# EAGLE design MTX_pic_piggyback_V11 (EAGLE 6.1)
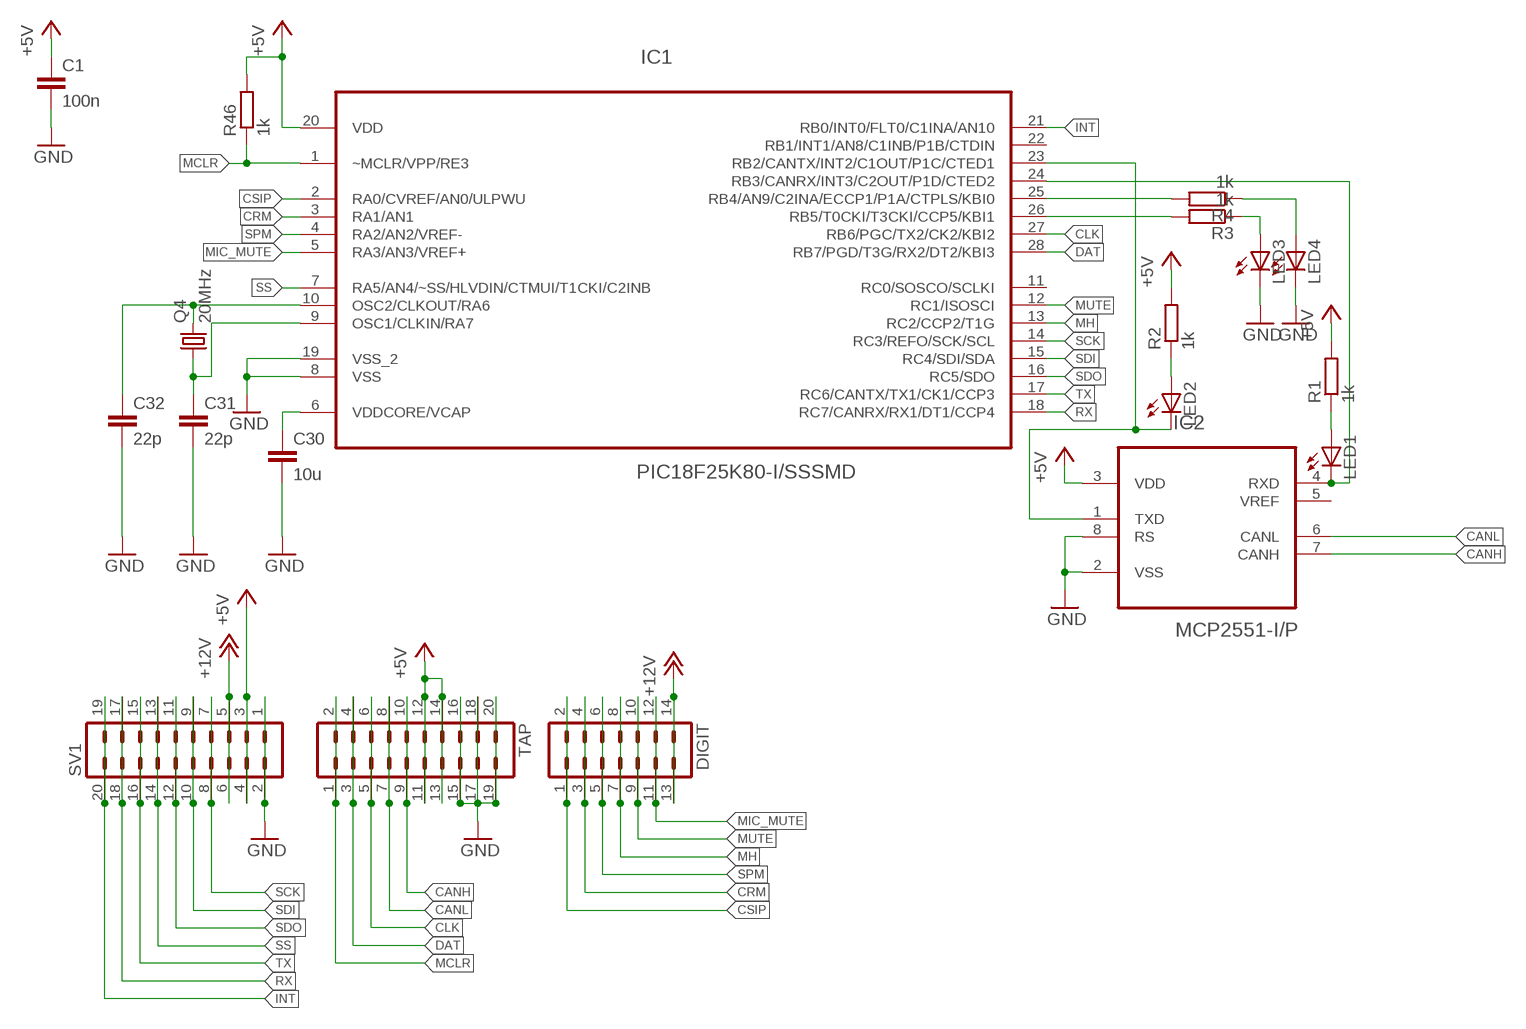
[diagram p0: schematic, sheet 1]

## Parts
C1  100n  C-EUC0805  [C0805]
C30  10u  C-EUC0805  [C0805]
C31  22p  C-EUC0805  [C0805]
C32  22p  C-EUC0805  [C0805]
DIGIT  MA07-2  [MA07-2]
IC1  PIC18F25K80-I/SSSMD  [SOP65P780X200-28N]
IC2  MCP2551-I/P  [DIP254P762X432-8]
LED1  LEDCHIP-LED0805  [CHIP-LED0805]
LED2  LEDCHIP-LED0805  [CHIP-LED0805]
LED3  LEDCHIP-LED0805  [CHIP-LED0805]
LED4  LEDCHIP-LED0805  [CHIP-LED0805]
Q4  20MHz  CRYSTALHC49UP  [HC49UP]
R1  1k  R-EU_R0805  [R0805]
R2  1k  R-EU_R0805  [R0805]
R3  1k  R-EU_R0805  [R0805]
R4  1k  R-EU_R0805  [R0805]
R46  1k  R-EU_R0805  [R0805]
SV1  MA10-2  [MA10-2]
TAP  MA10-2  [MA10-2]

## Nets
+5V: C1.1 IC1.20(VDD) IC2.3(VDD) R1.2 R2.2 R46.2 SV1.3 SV1.4 TAP.11 TAP.12 TAP.13 TAP.14
+12V: DIGIT.13 DIGIT.14 SV1.5 SV1.6
CANH: IC2.7(CANH) TAP.9 TAP.10
CANL: IC2.6(CANL) TAP.7 TAP.8
CLK: IC1.27(RB6/PGC/TX2/CK2/KBI2) TAP.5 TAP.6
CRM: DIGIT.3 DIGIT.4 IC1.3(RA1/AN1)
CSIP: DIGIT.1 DIGIT.2 IC1.2(RA0/CVREF/AN0/ULPWU)
DAT: IC1.28(RB7/PGD/T3G/RX2/DT2/KBI3) TAP.3 TAP.4
GND: C1.2 C30.2 C31.2 C32.2 IC1.8(VSS) IC1.19(VSS_2) IC2.2(VSS) IC2.8(RS) LED3.C LED4.C SV1.1 SV1.2 TAP.15 TAP.16 TAP.17 TAP.18 TAP.19 TAP.20
INT: IC1.21(RB0/INT0/FLT0/C1INA/AN10) SV1.19 SV1.20
MCLR: IC1.1(~MCLR/VPP/RE3) R46.1 TAP.1 TAP.2
MH: DIGIT.7 DIGIT.8 IC1.13(RC2/CCP2/T1G)
MIC_MUTE: DIGIT.11 DIGIT.12 IC1.5(RA3/AN3/VREF+)
MUTE: DIGIT.9 DIGIT.10 IC1.12(RC1/ISOSCI)
N$1: LED1.A R1.1
N$2: LED2.A R2.1
N$3: LED3.A R3.1
N$4: IC1.26(RB5/T0CKI/T3CKI/CCP5/KBI1) R3.2
N$5: LED4.A R4.1
N$6: IC1.25(RB4/AN9/C2INA/ECCP1/P1A/CTPLS/KBI0) R4.2
N$57: C30.1 IC1.6(VDDCORE/VCAP)
N$58: C31.1 IC1.9(OSC1/CLKIN/RA7) Q4.1
N$59: C32.1 IC1.10(OSC2/CLKOUT/RA6) Q4.2
N$86: IC1.24(RB3/CANRX/INT3/C2OUT/P1D/CTED2) IC2.4(RXD) LED1.C
N$87: IC1.23(RB2/CANTX/INT2/C1OUT/P1C/CTED1) IC2.1(TXD) LED2.C
RX: IC1.18(RC7/CANRX/RX1/DT1/CCP4) SV1.17 SV1.18
SCK: IC1.14(RC3/REFO/SCK/SCL) SV1.7 SV1.8
SDI: IC1.15(RC4/SDI/SDA) SV1.9 SV1.10
SDO: IC1.16(RC5/SDO) SV1.11 SV1.12
SPM: DIGIT.5 DIGIT.6 IC1.4(RA2/AN2/VREF-)
SS: IC1.7(RA5/AN4/~SS/HLVDIN/CTMUI/T1CKI/C2INB) SV1.13 SV1.14
TX: IC1.17(RC6/CANTX/TX1/CK1/CCP3) SV1.15 SV1.16
Unconnected: IC1.11(RC0/SOSCO/SCLKI) IC1.22(RB1/INT1/AN8/C1INB/P1B/CTDIN) IC2.5(VREF)

## Library data of the parts
C1 C30-C32 = rcl:C-EU: CAPACITOR, European symbol
DIGIT = con-lstb:MA07-2: PIN HEADER; OC_FARNELL: unknown; OC_NEWARK: unknown
IC1 = Microchip_By_element14_Batch_1:PIC18F25K80-I/SS
IC2 = Microchip_By_element14_Batch_1:MCP2551-I/P: High-Speed CAN Transceiver; DESCRIPTION: CAN CTRL; MPN: MCP2551-I/P; OC_FARNELL: 1292240; OC_NEWARK: 61K2947; PACKAGE: PDIP-8; SUPPLIER: Microchip
LED1-LED4 = led:LED: LED OSRAM: - CHIPLED LG R971, LG N971, LY N971, LG Q971, LY Q971, LO R971, LY R971 LH N974, LH R974 LS Q976, LO Q976, LY Q976 LO Q996 - Hyper CHIPLED LW Q18S LB Q993, LB Q99A, LB R99A - SideLED LS A670, LO A670, LY A670, LG A670, LP A670 LB A673, LV A673, LT A673, LW A673 LH A674 LY A675 LS A676, LA A676, LO A676, LY A676, LW A676 LS A679, LY A679, LG A679 - Hyper Micro SIDELED® LS Y876, LA Y876, LO Y876, LY Y876 LT Y87S - SmartLED LW L88C, LW L88S LB L89C, LB L89S, LG L890 LS L89K, LO L89K, LY L89K LS L896, LA L896, LO L896, LY L896 - TOPLED LS T670, LO T670, LY T670, LG T670, LP T670 LSG T670, LSP T670, LSY T670, LOP T670, LYG T670 LG T671, LOG T671, LSG T671 LB T673, LV T673, LT T673, LW T673 LH T674 LS T676, LA T676, LO T676, LY T676, LB T676, LH T676, LSB T676, LW T676 LB T67C, LV T67C, LT T67C, LS T67K, LO T67K, LY T67K, LW E67C LS E67B, LA E67B, LO E67B, LY E67B, LB E67C, LV E67C, LT E67C LW T67C LS T679, LY T679, LG T679 LS T770, LO T770, LY T770, LG T770, LP T770 LB T773, LV T773, LT T773, LW T773 LH T774 LS E675, LA E675, LY E675, LS T675 LS T776, LA T776, LO T776, LY T776, LB T776 LHGB T686 LT T68C, LB T68C - Hyper Mini TOPLED® LB M676 - Mini TOPLED Santana® LG M470 LS M47K, LO M47K, LY M47K Source: http://www.osram.convergy.de LUXEON: - LUMILED® LXK2-PW12-R00, LXK2-PW12-S00, LXK2-PW14-U00, LXK2-PW14-V00 LXK2-PM12-R00, LXK2-PM12-S00, LXK2-PM14-U00 LXK2-PE12-Q00, LXK2-PE12-R00, LXK2-PE12-S00, LXK2-PE14-T00, LXK2-PE14-U00 LXK2-PB12-K00, LXK2-PB12-L00, LXK2-PB12-M00, LXK2-PB14-N00, LXK2-PB14-P00, LXK2-PB14-Q00 LXK2-PR12-L00, LXK2-PR12-M00, LXK2-PR14-Q00, LXK2-PR14-R00 LXK2-PD12-Q00, LXK2-PD12-R00, LXK2-PD12-S00 LXK2-PH12-R00, LXK2-PH12-S00 LXK2-PL12-P00, LXK2-PL12-Q00, LXK2-PL12-R00 Source: www.luxeon.com KINGBRIGHT: KA-3528ASYC Source: www.kingbright.com
Q4 = crystal:CRYSTAL: CRYSTAL; OC_FARNELL: unknown; OC_NEWARK: unknown
R1-R4 R46 = rcl:R-EU_: RESISTOR, European symbol
SV1 TAP = con-lstb:MA10-2: PIN HEADER; OC_FARNELL: unknown; OC_NEWARK: unknown

## Board
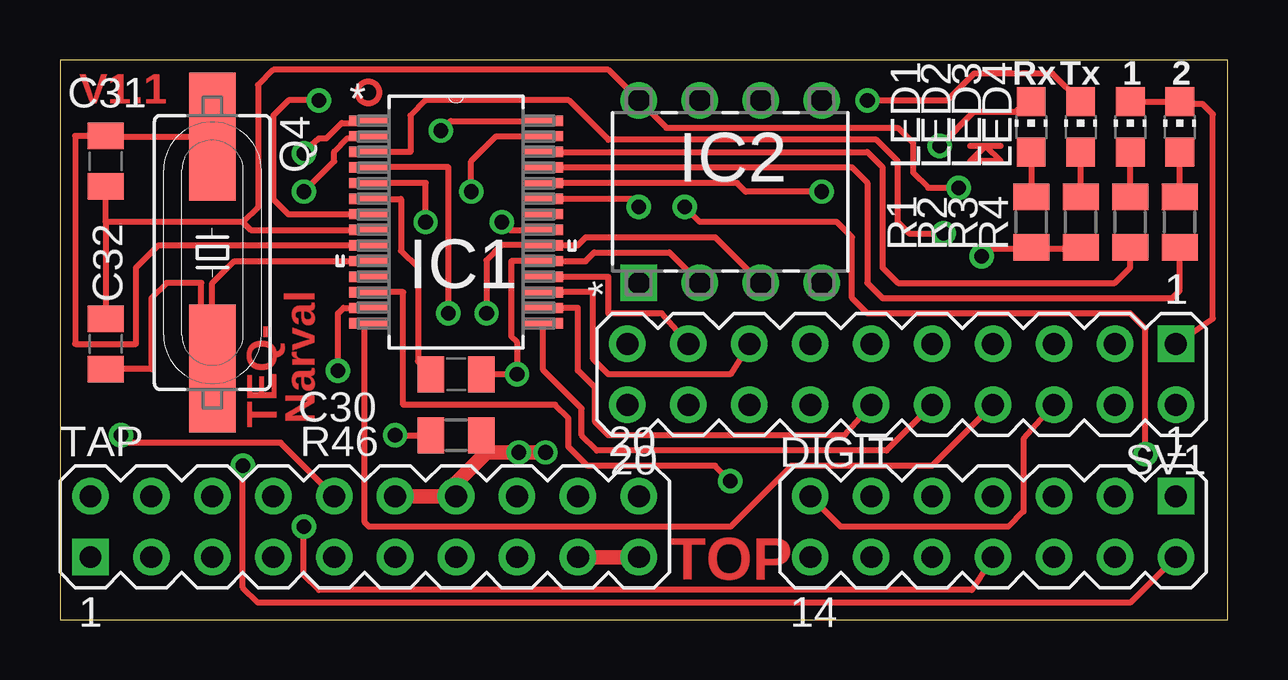
[diagram p1: board, top side]
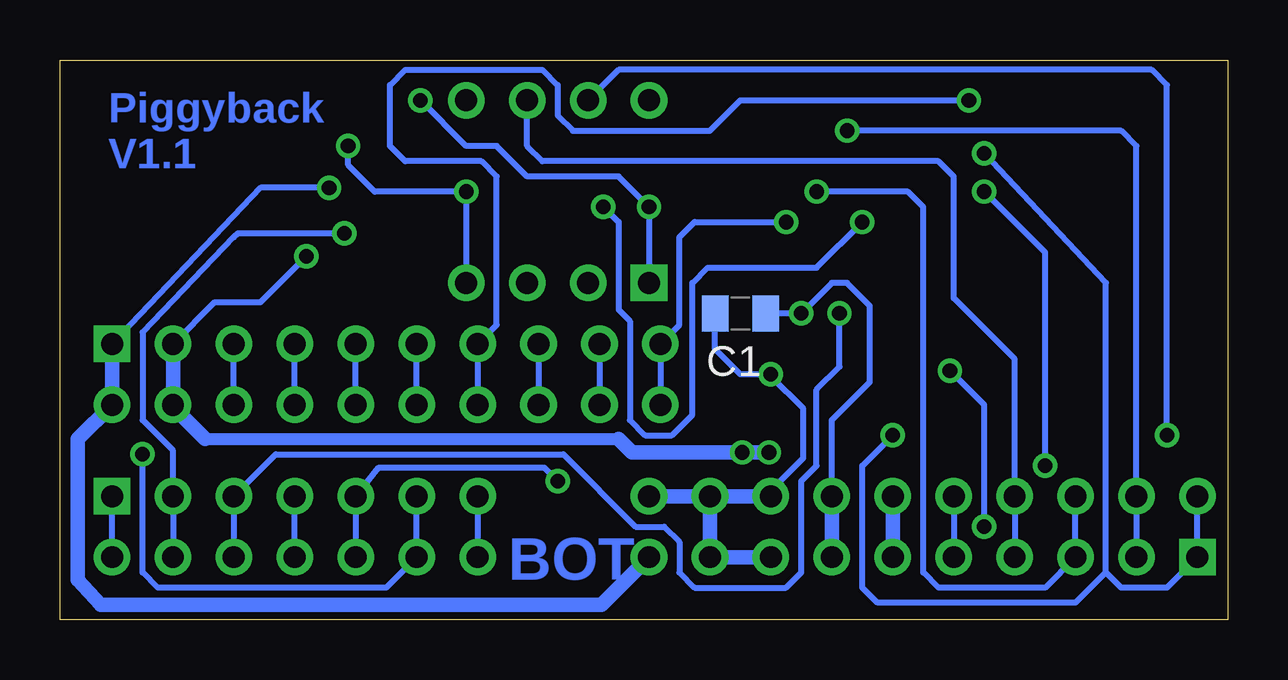
[diagram p2: board, bottom side, seen from below]

Size 48.68 x 23.35 mm. Coordinates in mm from the lower left corner, seen from the top.
Outline: 0,0 48.68,0 48.68,23.35 0,23.35 0,0
Copper layers (1*16): Top 0.035mm / dielectric 1.5mm / Bottom 0.035mm
Design rules: minimum track width 10mil, minimum drill 24mil, track to track 10mil, track to pad 10mil, pad to pad 10mil, via to via 10mil, smd to smd 10mil, copper to edge 10mil, drill to drill 10mil, minimum pad ring 10mil, minimum via ring 8mil, stop-mask expansion 4mil, vias tented up to drill 0mil, thermal gap 10mil

### Footprints (pad centres in the part's own frame; a part is rotated, then mirrored left to right if it is on the bottom)
C0805 = smd 1.1 x 1.5: 1 -1.05,0; 2 1.05,0
MA07-2 = drill 0.914 pad 1.524 square: 1 -7.62,-1.27 | drill 0.914 pad 1.524: 2 -7.62,1.27; 3 -5.08,-1.27; 4 -5.08,1.27; 5 -2.54,-1.27; 6 -2.54,1.27; 7 0,-1.27; 8 0,1.27; 9 2.54,-1.27; 10 2.54,1.27; 11 5.08,-1.27; 12 5.08,1.27; 13 7.62,-1.27; 14 7.62,1.27
SOP65P780X200-28N = smd 1.651 x 0.432: 1 -3.632,4.216; 2 -3.632,3.581; 3 -3.632,2.921; 4 -3.632,2.286; 5 -3.632,1.626; 6 -3.632,0.965; 7 -3.632,0.33; 8 -3.632,-0.33; 9 -3.632,-0.965; 10 -3.632,-1.626; 11 -3.632,-2.286; 12 -3.632,-2.921; 13 -3.632,-3.581; 14 -3.632,-4.216; 15 3.632,-4.216; 16 3.632,-3.581; 17 3.632,-2.921; 18 3.632,-2.286; 19 3.632,-1.626; 20 3.632,-0.965; 21 3.632,-0.33; 22 3.632,0.33; 23 3.632,0.965; 24 3.632,1.626; 25 3.632,2.286; 26 3.632,2.921; 27 3.632,3.581; 28 3.632,4.216
DIP254P762X432-8 = drill 0.914 pad 1.524 square: 1 -3.81,3.81 | drill 0.914 pad 1.524: 2 -3.81,1.27; 3 -3.81,-1.27; 4 -3.81,-3.81; 5 3.81,-3.81; 6 3.81,-1.27; 7 3.81,1.27; 8 3.81,3.81
CHIP-LED0805 = smd 1.2 x 1.2: A 0,-1.05; C 0,1.05
HC49UP = smd 5.334 x 1.93: 1 -4.826,0; 2 4.826,0
R0805 = smd 1.1 x 1.5: 1 -1.05,0; 2 1.05,0
MA10-2 = drill 0.914 pad 1.524 square: 1 -11.43,-1.27 | drill 0.914 pad 1.524: 2 -11.43,1.27; 3 -8.89,-1.27; 4 -8.89,1.27; 5 -6.35,-1.27; 6 -6.35,1.27; 7 -3.81,-1.27; 8 -3.81,1.27; 9 -1.27,-1.27; 10 -1.27,1.27; 11 1.27,-1.27; 12 1.27,1.27; 13 3.81,-1.27; 14 3.81,1.27; 15 6.35,-1.27; 16 6.35,1.27; 17 8.89,-1.27; 18 8.89,1.27; 19 11.43,-1.27; 20 11.43,1.27

### Placement (x,y rotation side)
C1  20.32,12.78 180 bottom
C30  16.51,10.24 0 top
C31  1.91,19.13 270 top
C32  1.91,11.51 90 top
DIGIT  38.89,3.89 180 top
IC1  16.51,16.59 0 top
IC2  27.94,17.86 90 top
LED1  40.48,20.56 0 top
LED2  42.55,20.56 0 top
LED3  44.61,20.56 0 top
LED4  46.67,20.56 0 top
Q4  6.35,15.32 270 top
R1  40.48,16.59 270 top
R2  42.55,16.59 270 top
R3  44.61,16.59 270 top
R4  46.67,16.59 270 top
R46  16.51,7.7 0 top
SV1  35.08,10.24 180 top
TAP  12.7,3.89 0 top

### Tracks (layer width: path | path; a pad name or v marks a point on that pad's centre or on a via)
+5V  (via drill 0.61, 0.61 pad 1.02)
  Top 0.254: IC2.3 27.3,15.95 21.92,15.95 21.59,15.62 IC1.20 18.41,15.62 17.78,14.99 v17.78,12.78 | v38.42,15.16 38.58,15.48 40.32,15.48 40.32,15.64 40.48,15.48 40.64,15.48 42.47,15.48 42.55,15.48
  Top 0.61: TAP.12 TAP.14 16.51,5.72 17.78,6.99 | 17.78,6.99 v20.24,6.99 | R46.2 17.78,7.48 17.78,6.99 | R1.2 40.54,15.48 40.64,15.48 | R2.2 42.48,15.48 42.47,15.48
  Bottom 0.254: TAP.14 16.51,8.33 14.92,9.92 14.92,13.1 15.88,14.05 16.51,14.05 v17.78,12.78 C1.1 | SV1.3 42.23,13.26 40.32,13.26 v38.42,15.16
  Bottom 0.508: 42.62,7.54 25.4,7.54
  Bottom 0.61: SV1.3 SV1.4 43.97,8.89 42.62,7.54 | TAP.14 TAP.13 | TAP.12 TAP.11 | 25.4,7.54 24.84,6.99 v20.24,6.99 v19.13,6.99 18.97,6.99
+12V
  Top 0.254: SV1.6 40.16,7.54 40.16,4.52 39.53,3.89 32.54,3.89 DIGIT.13
  Bottom 0.254: SV1.6 SV1.5 | DIGIT.13 DIGIT.14
CANH  (via drill 0.61 pad 1.02)
  Top 0.254: TAP.10 9.21,7.38 2.86,7.38 v2.54,7.7
  Bottom 0.254: v2.54,7.7 2.54,22.3 3.17,22.94 25.4,22.94 IC2.7 | TAP.10 TAP.9
CANL
  Bottom 0.254: IC2.6 29.21,19.76 28.57,19.13 12.06,19.13 11.43,18.49 11.43,13.41 8.89,10.87 TAP.8 TAP.7
CLK  (via drill 0.61 pad 1.02)
  Top 0.254: v17.14,17.86 17.14,19.13 18.19,20.17 IC1.27
  Bottom 0.254: v17.14,17.86 13.34,17.86 12.7,17.22 12.7,1.98 12.06,1.35 7.62,1.35 TAP.5 TAP.6
CRM  (via drill 0.61 pad 1.02)
  Top 0.254: IC1.3 14.61,19.51 14.61,21.03 15.24,21.67 21.21,21.67 22.86,20.02 34.04,20.02 34.92,19.13 34.92,16.59 35.4,16.11 v36.83,16.11
  Bottom 0.254: DIGIT.4 DIGIT.3 43.97,7.06 45.24,8.33 45.24,11.99 41.43,15.95 41.27,16.11 41.2,16.11 v36.83,16.11
CSIP  (via drill 0.61 pad 1.02)
  Top 0.254: v10.16,17.86 11.43,19.13 11.43,19.54 11.98,20.08 12.06,20.08 IC1.2 | DIGIT.2 44.61,0.71 8.26,0.71 7.62,1.35 v7.62,6.43
  Bottom 0.254: v7.62,6.43 7.62,15.32 v10.16,17.86 | DIGIT.2 DIGIT.1
DAT  (via drill 0.61 pad 1.02)
  Top 0.254: v15.88,20.4 16.28,20.81 IC1.28
  Bottom 0.254: v15.88,20.4 4.45,20.4 3.81,19.76 TAP.4 TAP.3
GND  (via drill 0.61 pad 1.02)
  Top 0.254: 7.62,16.59 1.91,16.59 | 1.91,16.59 C32.2 | 7.62,16.59 8.26,17.22 8.26,22.3 8.89,22.94 22.86,22.94 IC2.8 25.27,20.53 34.92,20.53 35.56,19.89 35.56,18.65 36.2,18.02 v37.47,18.02 | SV1.1 48.05,12.57 48.05,21.08 47.62,21.51 46.83,21.51 46.67,21.67 | IC2.2 25.4,15.32 22.26,15.32 21.91,14.96 IC1.19 18.8,14.96 18.8,11.83 19.05,11.58 v19.05,10.24 C30.2 | 7.62,16.59 7.95,16.26 IC1.8 | 1.91,16.59 C31.2 | LED3.C LED4.C
  Top 0.61: TAP.17 TAP.19 | LED4.C 46.77,21.51 46.83,21.51 | C32.2 | C31.2
  Bottom 0.254: TAP.16 19.05,5.4 17.7,6.75 17.7,8.81 19.05,10.16 v19.05,10.24 20.32,10.24 21.37,11.29 C1.2 | v37.47,18.02 40.32,18.02 SV1.1 | C1.2
  Bottom 0.61: TAP.15 TAP.17 TAP.18 | TAP.18 TAP.20 | TAP.16 TAP.18 | SV1.1 SV1.2 47.94,7.54 47.94,1.67 46.99,0.64 26.11,0.64 TAP.19
INT  (via drill 0.61 pad 1.02)
  Top 0.254: v18.41,16.59 18.75,16.26 IC1.21
  Bottom 0.254: v18.41,16.59 22.23,16.59 22.86,15.95 22.86,12.3 SV1.19 SV1.20
MCLR  (via drill 0.61 pad 1.02)
  Top 0.254: v13.97,7.7 R46.1 | v10.16,19.45 10.16,19.54 10.79,20.08 11.11,20.08 11.75,20.72 12.79,20.72 IC1.1
  Bottom 0.254: 5.08,1.98 4.45,1.35 2.54,1.35 TAP.1 TAP.2 | 5.08,1.98 6.35,0.71 14.61,0.71 15.24,1.35 15.24,6.43 v13.97,7.7 | 5.08,1.98 5.08,14.05 v10.16,19.45
MH  (via drill 0.61 pad 1.02)
  Top 0.254: v11.59,10.4 11.59,12.78 11.82,13.01 IC1.13 | DIGIT.8 38.01,1.25 10.79,1.25 10.16,1.89 v10.16,3.89
  Bottom 0.254: v10.16,3.89 10.16,8.97 v11.59,10.4 | DIGIT.8 DIGIT.7
MIC_MUTE  (via drill 0.61 pad 1.02)
  Top 0.254: v15.24,16.59 15.24,18.22 IC1.5 | v45.24,6.91 45.24,12.14 44.61,12.78 33.66,12.78 33.02,13.41 33.02,15.95 32.38,16.59 26.67,16.59 v26.04,17.22
  Bottom 0.254: v26.04,17.22 25.4,16.59 25.4,12.94 24.92,12.46 24.92,8.33 24.29,7.7 23.18,7.7 22.33,8.55 22.33,14.05 21.69,14.68 17.14,14.68 v15.24,16.59 | v45.24,6.91 45.24,1.98 44.61,1.35 35.08,1.35 DIGIT.12 DIGIT.11
MUTE  (via drill 0.61 pad 1.02)
  Top 0.254: v27.94,5.79 27.3,6.43 21.99,6.43 21.19,7.22 21.19,8.41 20.64,8.97 14.31,8.97 14.31,13.67 IC1.12
  Bottom 0.254: v27.94,5.79 28.5,6.35 35.4,6.35 DIGIT.9 DIGIT.10
N$1
  Top 0.254: LED1.A R1.1 40.32,17.54
N$2
  Top 0.254: R2.1 LED2.A
N$3
  Top 0.254: R3.1 LED3.A
N$4
  Top 0.254: IC1.26 33.66,19.51 34.29,18.88 34.29,14.68 34.92,14.05 43.97,14.05 44.61,14.68 R3.2
N$5
  Top 0.254: R4.1 LED4.A
N$6
  Top 0.254: IC1.25 33.02,18.88 33.66,18.24 33.66,14.05 34.29,13.41 46.35,13.41 46.67,13.73 R4.2
N$10
  Top 0.254: 39.21,19.13 37.94,19.13 38.58,19.76 39.21,19.13
N$11
  Top 0.254: 39.21,19.76 37.94,19.76
N$57
  Top 0.254: IC1.6 14.22,17.55 14.22,15.39 14.92,14.68 14.92,10.78 C30.1 | C30.1
N$58
  Top 0.254: IC1.9 4.12,15.62 3.17,14.68 3.17,11.51 0.64,11.51 0.64,20.18 C31.1 1.91,20.15 Q4.1
  Top 0.61: C31.1
N$59
  Top 0.254: IC1.10 7.26,14.96 6.35,14.05 Q4.2 5.89,10.49 5.89,14.05 4.45,14.05 3.81,13.41 3.81,10.46 C32.1
  Top 0.61: C32.1
N$86  (via drill 0.61 pad 1.02)
  Top 0.254: v31.75,17.86 28.57,17.86 28.22,18.22 IC1.24 | v36.67,19.76 38.1,21.19 39.85,21.19 40.32,21.67
  Top 0.61: 40.32,21.67 40.38,21.61 LED1.C
  Bottom 0.254: IC2.4 v31.75,17.86 35.56,17.86 36.67,18.97 v36.67,19.76
N$87  (via drill 0.61 pad 1.02)
  Top 0.254: v24.13,17.22 23.8,17.55 IC1.23 | v33.66,21.67 36.99,21.67 38.1,22.78 41.37,22.78 LED2.C
  Bottom 0.254: v33.66,21.67 31.75,19.76 30.48,19.76 29.21,18.49 25.4,18.49 v24.13,17.22 IC2.1
RX
  Top 0.254: SV1.17 25.08,12.78 22.86,12.78 22.86,14.3 IC1.18
  Bottom 0.254: SV1.17 SV1.18
SCK
  Top 0.254: SV1.8 36.35,6.43 30.48,6.43 27.94,3.89 12.88,3.89 12.7,4.07 12.7,12.3 IC1.14
  Bottom 0.254: SV1.8 SV1.7
SDI
  Top 0.254: SV1.10 34.45,7.06 22.38,7.06 21.75,7.7 21.75,8.81 20.14,10.42 IC1.15
  Bottom 0.254: SV1.10 SV1.9
SDO
  Top 0.254: SV1.12 32.7,7.7 22.86,7.7 22.3,8.26 22.3,9.68 21.59,10.4 21.59,13.01 IC1.16
  Bottom 0.254: SV1.12 SV1.11
SPM  (via drill 0.61 pad 1.02)
  Top 0.254: v16.19,12.78 16.19,18.88 IC1.4
  Bottom 0.254: v16.19,12.78 16.19,10.56 17.14,9.6 17.14,6.43 17.78,5.79 17.78,1.98 18.41,1.35 22.23,1.35 22.86,1.98 22.86,3.25 23.5,3.89 24.69,3.89 27.7,6.91 39.69,6.91 DIGIT.5 DIGIT.6
SS  (via drill 0.61 pad 1.02)
  Top 0.254: v10.79,21.67 9.53,21.67 8.89,21.03 8.89,17.54 9.51,16.92 IC1.7
  Bottom 0.254: v10.79,21.67 20.32,21.67 21.59,20.4 27.3,20.4 27.94,21.03 27.94,22.3 28.57,22.94 34.29,22.94 34.92,22.3 34.92,19.76 34.29,19.13 31.11,19.13 30.48,18.49 30.48,12.3 SV1.13 SV1.14
TX
  Top 0.254: SV1.15 27.94,10.24 22.86,10.24 22.23,10.87 22.23,13.67 IC1.17
  Bottom 0.254: SV1.15 SV1.16
(copper drawn outside any net)
  shapes: Top circle x1

### Text on the board
Top: V1.1 | TEQ- | Narval | TOP
Bottom: Piggyback | V1.1 | BOT
tNames: Rx | Tx | 1 | 2
tTest: RX | TX | SS | SDO | SDI | CLK | 12V | 5V | INT